# Altium schematic sheet Interface.SchDoc
size A; SheetNumber: 3; SheetTotal: 4
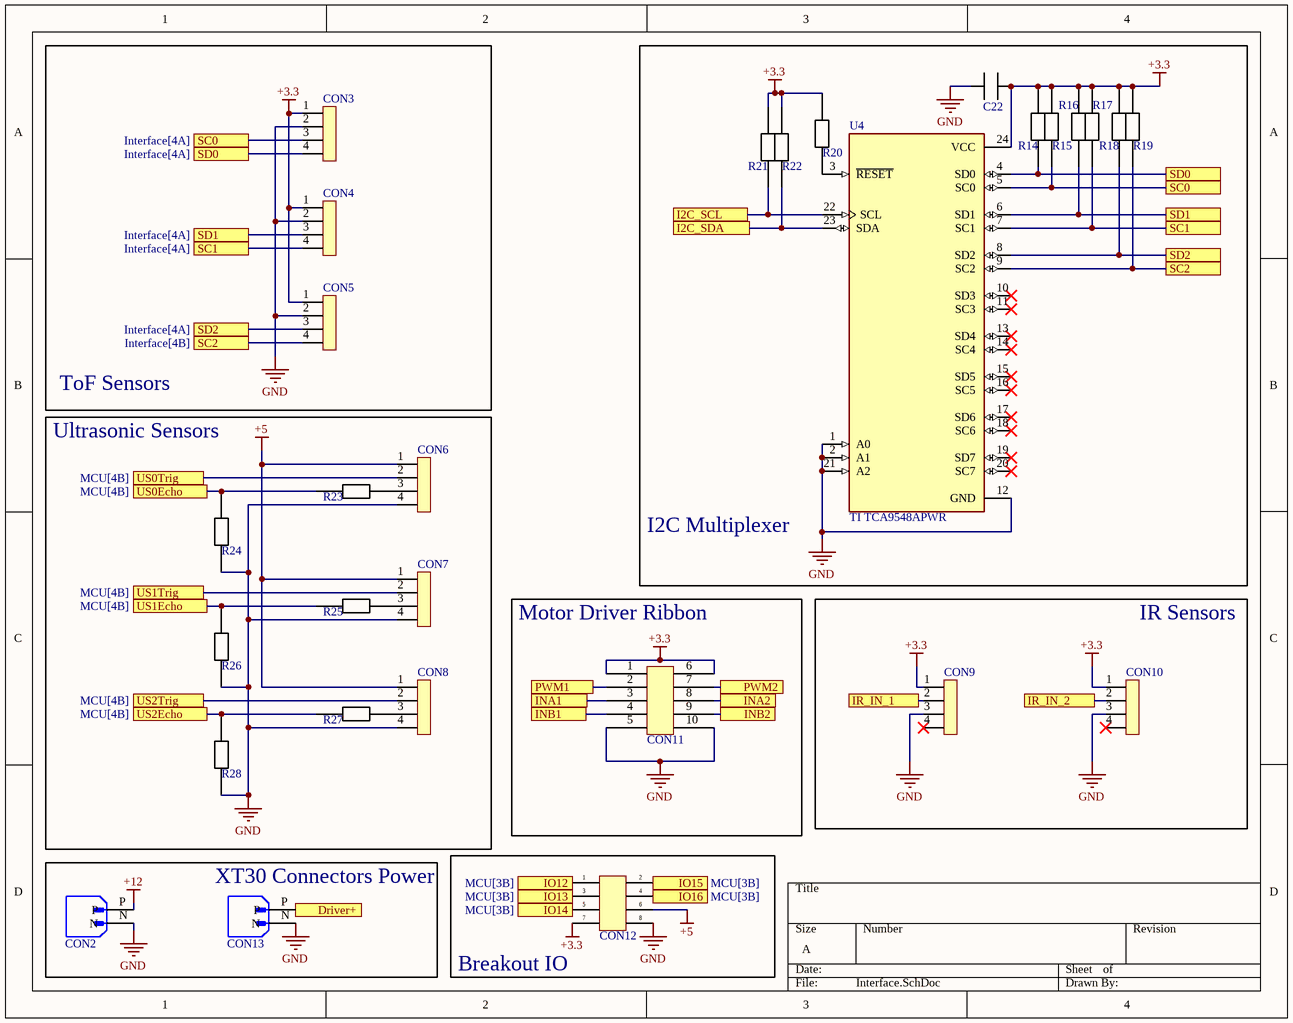
[diagram p0: Interface.SchDoc]

## Parts
C22  100nF  [CAP_0805]  (value not drawn)
CON2  Changzhou Amass Elec XT30PW-M30.G.Y  [XT30PW-M30.G.Y]  (value not drawn)
CON3  HX2.54mm connector  [CON_1x4_HX2.54mm]  (value not drawn)
CON4  HX2.54mm connector  [CON_1x4_HX2.54mm]  (value not drawn)
CON5  HX2.54mm connector  [CON_1x4_HX2.54mm]  (value not drawn)
CON6  HX2.54mm connector  [CON_1x4_HX2.54mm]  (value not drawn)
CON7  HX2.54mm connector  [CON_1x4_HX2.54mm]  (value not drawn)
CON8  HX2.54mm connector  [CON_1x4_HX2.54mm]  (value not drawn)
CON9  HX2.54mm connector  [CON_1x4_HX2.54mm]  (value not drawn)
CON10  HX2.54mm connector  [CON_1x4_HX2.54mm]  (value not drawn)
CON11  BOOMELE(Boom Precision Elec) 2.54-2*5P  [CON_IDC_2x5_2.54]  (value not drawn)
CON12  2x4 2.54mm THT  [CON_2x4_2.54MM_THT]  (value not drawn)
CON13  Changzhou Amass Elec XT30PW-M30.G.Y  [XT30PW-M30.G.Y]  (value not drawn)
R14  5k  [RES_0805]  (value not drawn)
R15  5k  [RES_0805]  (value not drawn)
R16  5k  [RES_0805]  (value not drawn)
R17  5k  [RES_0805]  (value not drawn)
R18  5k  [RES_0805]  (value not drawn)
R19  5k  [RES_0805]  (value not drawn)
R20  10k  [RES_0805]  (value not drawn)
R21  5k  [RES_0805]  (value not drawn)
R22  5k  [RES_0805]  (value not drawn)
R23  1k  [RES_0805]  (value not drawn)
R24  1k  [RES_0805]  (value not drawn)
R25  1k  [RES_0805]  (value not drawn)
R26  1k  [RES_0805]  (value not drawn)
R27  1k  [RES_0805]  (value not drawn)
R28  1k  [RES_0805]  (value not drawn)
U4  TI TCA9548APWR  [SOP65P640X120-24N]

## Blocks framed on the sheet
ToF Sensors: CON3-CON5
I2C Multiplexer: C22 R14-R22 U4
Ultrasonic Sensors: CON6-CON8 R23-R28
Motor Driver Ribbon: CON11
IR Sensors: CON9 CON10
XT30 Connectors Power: CON2 CON13
Breakout IO: CON12

## Ports
Driver+ (see Killswitch[4B]), I2C_SCL (see MCU[3B]), I2C_SDA (see MCU[3B]), INA1 (see MCU[3A]), INA2 (see MCU[3B]), INB1 (see MCU[3A]), INB2 (see MCU[3A]), IO12 (see MCU[3B]), IO13 (see MCU[3B]), IO14 (see MCU[3B]), IO15 (see MCU[3B]), IO16 (see MCU[3B]), IR_IN_1 (see MCU[3A]), IR_IN_2 (see MCU[3A]), PWM1 (see MCU[3A]), PWM2 (see MCU[3B]), SC0 (see Interface[1A]), SC0 (see Interface[4A]), SC1 (see Interface[1A]), SC1 (see Interface[4A]), SC2 (see Interface[1B]), SC2 (see Interface[4B]), SD0 (see Interface[1A]), SD0 (see Interface[4A]), SD1 (see Interface[1A]), SD1 (see Interface[4A]), SD2 (see Interface[1B]), SD2 (see Interface[4A]), US0Echo (see MCU[4B]), US0Trig (see MCU[4B]), US1Echo (see MCU[4B]), US1Trig (see MCU[4B]), US2Echo (see MCU[4B]), US2Trig (see MCU[4B])

## Nets
+3.3: C22.1 CON3.1 CON4.1 CON5.1 CON9.1 CON10.1 CON11.1 CON11.6 CON12.7 R14.2 R15.2 R16.2 R17.2 R18.2 R19.2 R20.2 R21.2 R22.2 U4.24(VCC)
+5: CON6.1 CON7.1 CON8.1 CON12.6
+12: CON2.P
GND: C22.2 CON2.N CON3.2 CON4.2 CON5.2 CON6.4 CON7.4 CON8.4 CON9.3 CON10.3 CON11.5 CON11.10 CON12.8 CON13.N R24.1 R26.1 R28.1 U4.1(A0) U4.2(A1) U4.12(GND) U4.21(A2)
Driver+: CON13.P ; port Driver+
I2C_SCL: R21.1 U4.22(SCL) ; port I2C_SCL
I2C_SDA: R22.1 U4.23(SDA) ; port I2C_SDA
INA1: CON11.3 ; port INA1
INA2: CON11.8 ; port INA2
INB1: CON11.4 ; port INB1
INB2: CON11.9 ; port INB2
IO12: CON12.1 ; port IO12
IO13: CON12.3 ; port IO13
IO14: CON12.5 ; port IO14
IO15: CON12.2 ; port IO15
IO16: CON12.4 ; port IO16
IR_IN_1: CON9.2 ; port IR_IN_1
IR_IN_2: CON10.2 ; port IR_IN_2
PWM1: CON11.2 ; port PWM1
PWM2: CON11.7 ; port PWM2
SC0: CON3.3 R15.1 U4.5(SC0) ; port SC0
SC1: CON4.4 R17.1 U4.7(SC1) ; port SC1
SC2: CON5.4 R19.1 U4.9(SC2) ; port SC2
SD0: CON3.4 R14.1 U4.4(SD0) ; port SD0
SD1: CON4.3 R16.1 U4.6(SD1) ; port SD1
SD2: CON5.3 R18.1 U4.8(SD2) ; port SD2
US0Echo: R23.1 R24.2 ; port US0Echo
US0Trig: CON6.2 ; port US0Trig
US1Echo: R25.1 R26.2 ; port US1Echo
US1Trig: CON7.2 ; port US1Trig
US2Echo: R27.1 R28.2 ; port US2Echo
US2Trig: CON8.2 ; port US2Trig
NetCON6_3: CON6.3 R23.2
NetCON7_3: CON7.3 R25.2
NetCON8_3: CON8.3 R27.2
NetR20_1: R20.1 U4.3(~{RESET})

Not connected (* = marked no-connect by the designer): CON9 4*; CON10 4*; U4 10(SD3)* 11(SC3)* 13(SD4)* 14(SC4)* 15(SD5)* 16(SC5)* 17(SD6)* 18(SC6)* 19(SD7)* 20(SC7)*

## Library data of the parts
C22 = CAP_0805: note: any manufacturer; val: 100nF
CON2 CON13 = XT30PW-M30.G.Y: Banana and Tip Connector Adapters RoHS; note: any manufacturer; val: Changzhou Amass Elec XT30PW-M30.G.Y; sample link: https://www.lcsc.com/product-detail/C431092.html
CON3-CON10 = CON_1x4_HX2.54mm: 4 Pin HX2.54mm Connector Straight Needle THT; val: HX2.54mm connector; sample link: https://item.taobao.com/item.htm?ali_refid=a3_430582_1006%3A1152101030%3AH%3AfECOJjAJsAVR%2BlV4HdXu0w%3D%3D%3Aff1c71a36a83a51d569faca3e6e2a003&ali_trackid=282_ff1c71a36a83a51d569faca3e6e2a003&id=609608021291&mi_id=0000quewLQZSFLFE1VxBLvft_H3MzoN4Rq4bTtf1JTcVhOg&mm_sceneid=1_0_131154039_0&priceTId=2100c82017726909854371638e0cc7&skuId=4282636056709&spm=a21n57.1.hoverItem.1&utparam=%7B%22aplus_abtest%22%3A%22fb4c3022eff1f28742f3a1e939f5d12a%22%7D&xxc=ad_ztc; sample link 2: https://item.taobao.com/item.htm?abbucket=7&id=597409212146&mi_id=0000Dv6-Sh6HdzdhlDj_dX79iQDtOYoD7Rc0flFh8CmAyxg&ns=1&priceTId=2100c82017726912298546935e0cc7&skuId=4248469041168&spm=a21n57.imgsearch.item.2&utparam=%7B%22aplus_abtest%22%3A%22a76dc8be5391ba4e801be3f8b99bb3a2%22%7D&xxc=taobaoSearch
CON11 = CON_IDC_2x5_2.54: IDC Connector 2x5 2.54mm pitch; note: any manufacturer; sample link: https://www.lcsc.com/product-detail/C5665.html?s_z=n_BOOMELE%28Boom%2520Precision%2520Elec%29%25202.54-2%2a5P; val: BOOMELE(Boom Precision Elec) 2.54-2*5P; sample link 2: https://item.taobao.com/item.htm?abbucket=6&id=993023982089&mi_id=0000GEDCW2nKoxRS0fGuseLde_Ydw6WZPxIkokftyIfzx-o&ns=1&priceTId=2100c88e17726963391222098e0cf7&skuId=5969453845356&spm=a21n57.1.hoverItem.2&utparam=%7B%22aplus_abtest%22%3A%22b8c570614af0c2c915e1844a14ab4fb4%22%7D&xxc=taobaoSearch
CON12 = CON_2x4_2.54mm_THT: note: any manufacturer; val: 2x4 2.54mm THT
R14-R28 = RES_0805: note: any manufacturer
  R14-R19 R21 R22: val: 5k
  R20: val: 10k
  R23-R28: val: 1k
U4 = TCA9548APWR: 1.65V~5.5V 400Kbps TSSOP-24 Signal Switches, Multiplexers, Decoders RoHS; val: TI TCA9548APWR; sample link: https://www.lcsc.com/product-detail/C130026.html?s_z=n_TCA9548A